# Altium schematic sheet MainBoard.SchDoc
size A2; Organization: Altium Limited; Address1: L3, 12a Rodborough Rd; Address2: Frenchs Forest; Address3: NSW; Address4: Australia 2086
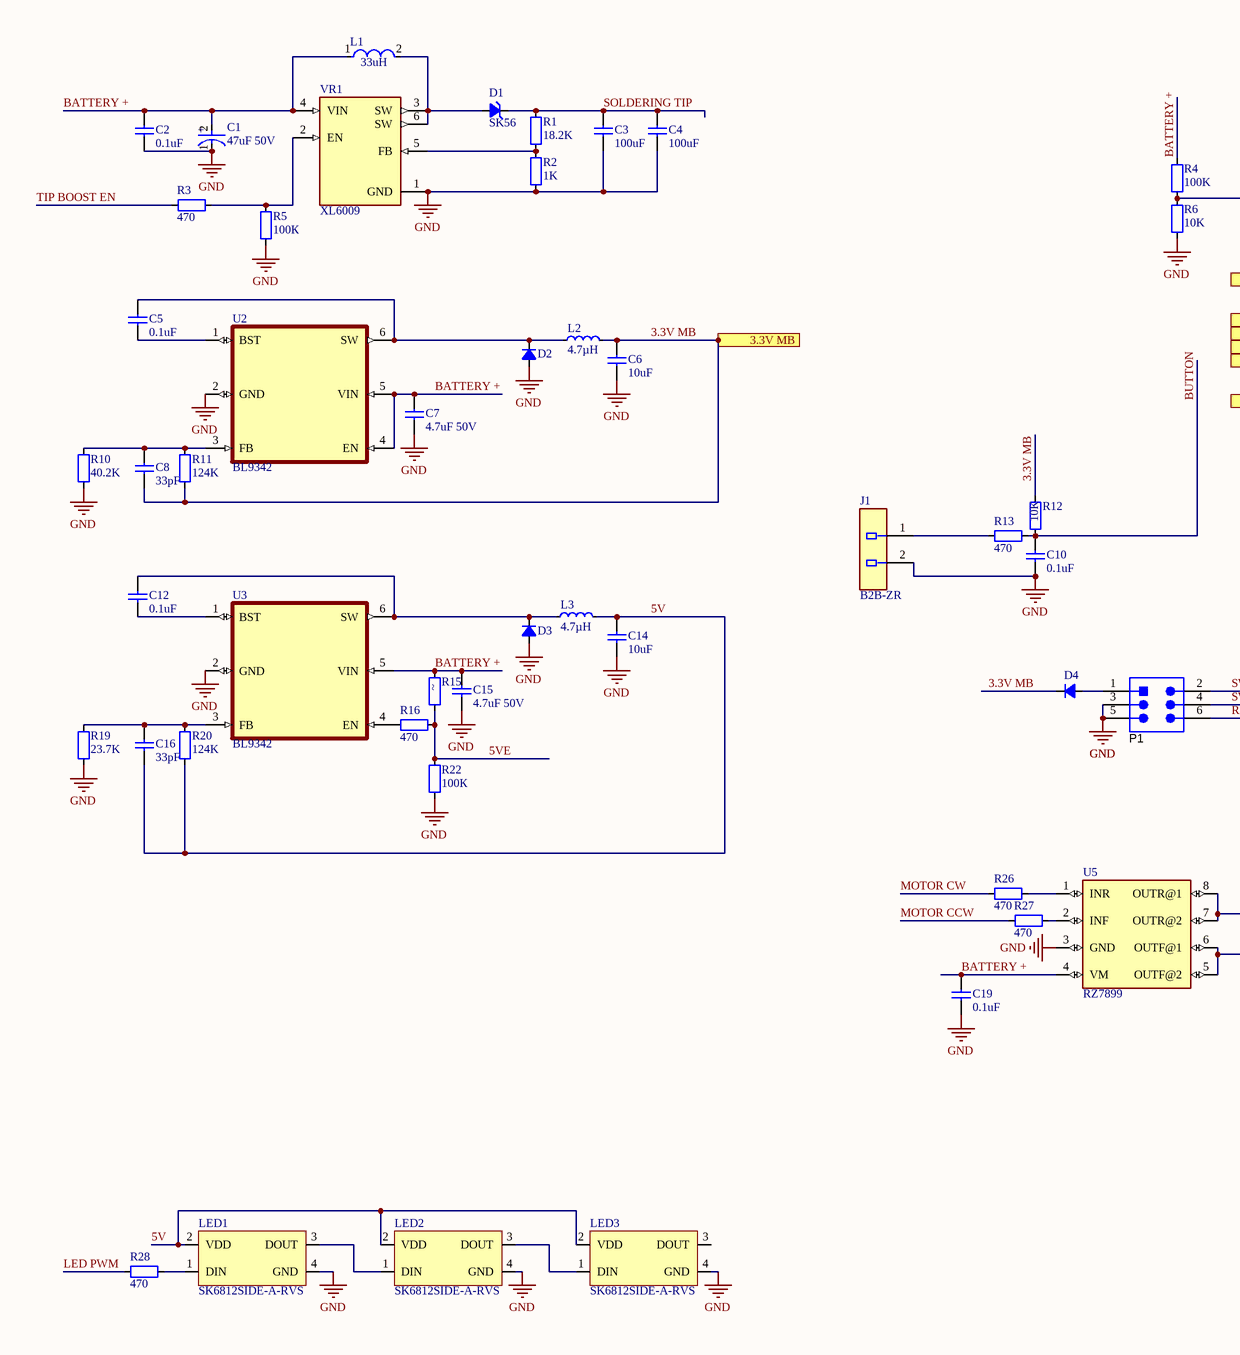
[diagram p0: MainBoard.SchDoc, left]
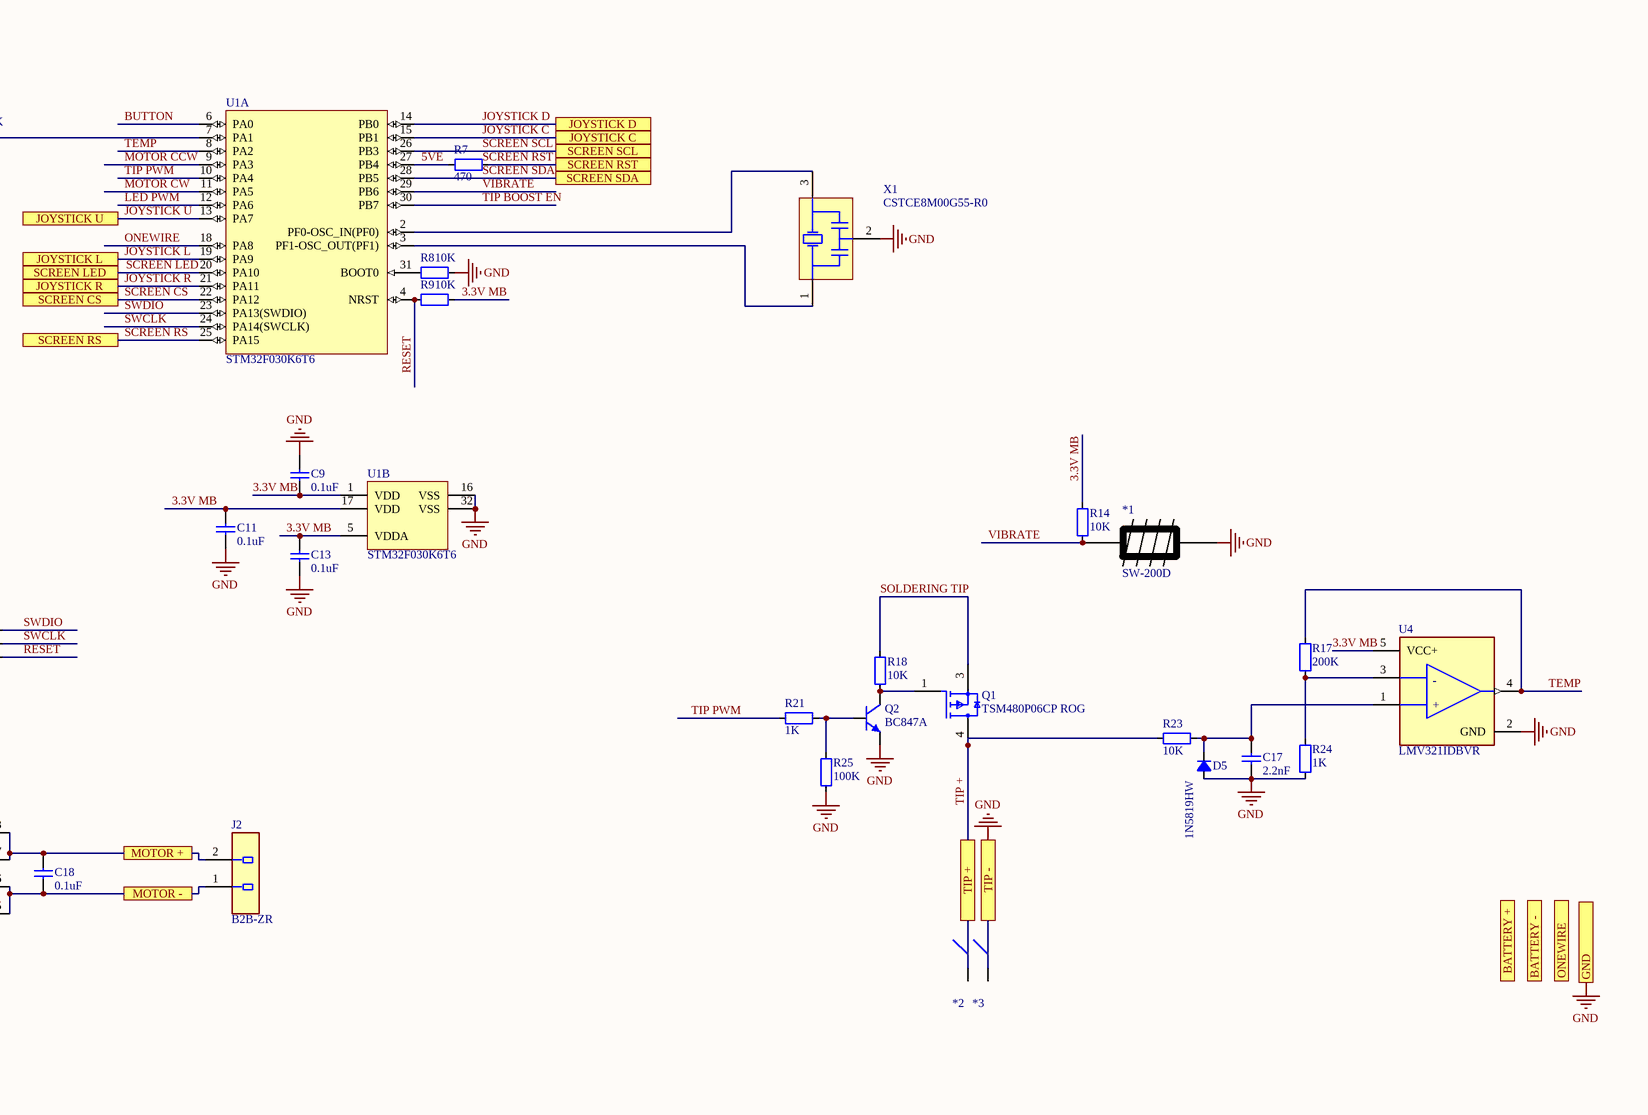
[diagram p1: MainBoard.SchDoc, right]

## Parts
*1  SW-200D  [SW-200D]
*2  Clipse  [CLIPSE]  (value not drawn)
*3  Clipse  [CLIPSE]  (value not drawn)
C1  47uF 50V  [FP-THV6.3X7.7-MFG]
C2  0.1uF  [1206]
C3  100uF  [C1210]
C4  100uF  [C1210]
C5  0.1uF  [R0603]
C6  10uF  [C0805]
C7  4.7uF 50V  [C0805]
C8  33pF  [R0603]
C9  0.1uF  [R0603]
C10  0.1uF  [R0603]
C11  0.1uF  [R0603]
C12  0.1uF  [R0603]
C13  0.1uF  [R0603]
C14  10uF  [C0805]
C15  4.7uF 50V  [C0805]
C16  33pF  [R0603]
C17  2.2nF  [R0603]
C18  0.1uF  [1206]
C19  0.1uF  [R0603]
D1  SK56  [DO-214AA(SMB)]
D2  (no value)  [SOD-123]
D3  (no value)  [SOD-123]
D4  (no value)  [SOD-123]
D5  1N5819HW  [SOD-123]
J1  Part Number: B2B-ZR  [JST_B2B-ZR_0]  (hidden comment: Conn_JST_B2B-ZR_eec)
J2  Part Number: B2B-ZR  [JST_B2B-ZR_0]  (hidden comment: Conn_JST_B2B-ZR_eec)
L1  value 33uH  [IND_1040]  (hidden comment: 1040)
L2  4.7µH  [INDC1608X06L]
L3  4.7µH  [INDC1608X06L]
LED1  SK6812SIDE-A-RVS  [SK6812SIDE-A-RVS]
LED2  SK6812SIDE-A-RVS  [SK6812SIDE-A-RVS]
LED3  SK6812SIDE-A-RVS  [SK6812SIDE-A-RVS]
P1  TSW-103-07-G-D  [DS-1025-05 - 2x3]  (value not drawn)
Q1  TSM480P06CP ROG  [FP-TO-252-MFG]
Q2  BC847A  [SOT95P237X112-3N]
R1  18.2K  [R0603]
R2  1K  [R0603]
R3  470  [R0603]
R4  100K  [R0603]
R5  100К  [R0603]
R6  10K  [R0603]
R7  470  [R0603]
R8  10K  [R0603]
R9  10K  [R0603]
R10  40.2K  [R0603]
R11  124K  [R0603]
R12  10K  [R0603]
R13  470  [R0603]
R14  10K  [R0603]
R15  ~  [R0603]
R16  470  [R0603]
R17  200K  [R0603]
R18  10K  [R0603]
R19  23.7K  [R0603]
R20  124K  [R0603]
R21  1K  [R0603]
R22  100К  [R0603]
R23  10K  [R0603]
R24  1K  [R0603]
R25  100K  [R0603]
R26  470  [R0603]
R27  470  [R0603]
R28  470  [R0603]
U1  STM32F030K6T6  [LQFP32_L]  (parts A,B of 2)
U2  BL9342  [SOT23-6]
U3  BL9342  [SOT23-6]
U4  LMV321IDBVR  [FP-DBV0005A-MFG]
U5  RZ7899  [SOP-8_2-5R1S-IPC_B]
VR1  XL6009  [DPAK170P1435X465-6N]
X1  CSTCE8M00G55-R0  [MURA-CSTCE_G_A-3_V]

## Ports
3.3V MB, BATTERY +, BATTERY -, GND, JOYSTICK C, JOYSTICK D, JOYSTICK L, JOYSTICK R, JOYSTICK U, MOTOR +, MOTOR -, ONEWIRE, SCREEN CS, SCREEN LED, SCREEN RS, SCREEN RST, SCREEN SCL, SCREEN SDA, TIP +, TIP -

## Nets
GND: *1.2 *3.1 C1.1(C) C2.1 C3.1 C4.1 C6.1 C7.1 C9.2 C10.1 C11.2 C13.2 C14.1 C15.1 C17.1 C19.2 D2.1(A) D3.1(A) D5.1(A) J1.2 LED1.4(GND) LED2.4(GND) LED3.4(GND) P1.3 P1.5 Q2.2(E) R2.2 R5.2 R6.1 R8.1 R10.1 R19.1 R22.2 R24.2 R25.1 U1.16(VSS) U1.32(VSS) U2.2(GND) U3.2(GND) U4.2(GND) U5.3(GND) VR1.1(GND) X1.2(GND) ; port TIP -, port GND
3.3V MB: C6.2 C8.1 C9.1 C11.1 C13.1 D4.2(K) L2.2 R9.1 R11.1 R12.1 R14.2 U1.1(VDD) U1.5(VDDA) U1.17(VDD) U4.5(VCC+) ; port 3.3V MB
5V: C14.2 C16.1 L3.2 LED1.2(VDD) LED2.2(VDD) LED3.2(VDD) R20.1
5VE: R7.2 R15.2 R16.1 R22.1 U1.27(PB4)
BATTERY +: C1.2(A) C2.2 C7.2 C15.2 C19.1 L1.1 R4.2 R15.1 U2.4(EN) U2.5(VIN) U3.5(VIN) U5.4(VM) VR1.4(VIN)
BUTTON: C10.2 R12.2 R13.2 U1.6(PA0)
JOYSTICK D: U1.14(PB0) ; port JOYSTICK D
JOYSTICK L: U1.19(PA9) ; port JOYSTICK L
JOYSTICK R: U1.21(PA11) ; port JOYSTICK R
JOYSTICK U: U1.13(PA7) ; port JOYSTICK U
JOYSTICK С: U1.15(PB1) ; port JOYSTICK C
LED PWM: R28.2 U1.12(PA6)
MOTOR +: C18.1 J2.2 U5.7(OUTR@2) U5.8(OUTR@1) ; port MOTOR +
MOTOR -: C18.2 J2.1 U5.5(OUTF@2) U5.6(OUTF@1) ; port MOTOR -
MOTOR CCW: R27.2 U1.9(PA3)
MOTOR CW: R26.2 U1.11(PA5)
ONEWIRE: U1.18(PA8)
RESET: P1.6 R9.2 U1.4(NRST)
SCREEN CS: U1.22(PA12) ; port SCREEN CS
SCREEN LED: U1.20(PA10) ; port SCREEN LED
SCREEN RS: U1.25(PA15) ; port SCREEN RS
SCREEN RST: R7.1 ; port SCREEN RST
SCREEN SCL: U1.26(PB3) ; port SCREEN SCL
SCREEN SDA: U1.28(PB5) ; port SCREEN SDA
SOLDERING TIP: C3.2 C4.2 D1.1(K) Q1.3(Source) R1.1 R18.2
SWCLK: P1.4 U1.24(PA14(SWCLK))
SWDIO: P1.2 U1.23(PA13(SWDIO))
TEMP: R17.1 U1.8(PA2) U4.4(OUT)
TIP +: *2.1 Q1.4(Drain) R23.1 ; port TIP +
TIP BOOST EN: R3.2 U1.30(PB7)
TIP PWM: R21.2 U1.10(PA4)
VIBRATE: *1.1 R14.1 U1.29(PB6)
NetC5_1: C5.1 U2.1(BST)
NetC5_2: C5.2 D2.2(K) L2.1 U2.6(SW)
NetC8_2: C8.2 R10.2 R11.2 U2.3(FB)
NetC12_1: C12.1 U3.1(BST)
NetC12_2: C12.2 D3.2(K) L3.1 U3.6(SW)
NetC16_2: C16.2 R19.2 R20.2 U3.3(FB)
NetC17_2: C17.2 D5.2(K) R23.2 U4.1(1IN+)
NetD1_2: D1.2(A) L1.2 VR1.3(SW) VR1.6(SW)
NetD4_1: D4.1(A) P1.1
NetJ1_1: J1.1 R13.1
NetLED1_1: LED1.1(DIN) R28.1
NetLED1_3: LED1.3(DOUT) LED2.1(DIN)
NetLED2_3: LED2.3(DOUT) LED3.1(DIN)
NetQ1_1: Q1.1(Gate) Q2.3(C) R18.1
NetQ2_1: Q2.1(B) R21.1 R25.2
NetR1_2: R1.2 R2.1 VR1.5(FB)
NetR3_1: R3.1 R5.1 VR1.2(EN)
NetR4_1: R4.1 R6.2 U1.7(PA1)
NetR8_2: R8.2 U1.31(BOOT0)
NetR16_2: R16.2 U3.4(EN)
NetR17_2: R17.2 R24.1 U4.3(1IN-)
NetR26_1: R26.1 U5.1(INR)
NetR27_1: R27.1 U5.2(INF)
NetU1_2: U1.2(PF0-OSC_IN(PF0)) X1.3(X2)
NetU1_3: U1.3(PF1-OSC_OUT(PF1)) X1.1(X1)

Not connected (* = marked no-connect by the designer): LED3 3(DOUT)

## Notes on the sheet
- Labels drawn without touching a wire or pin: SCREEN RST
- Title
- Size:
- Date:
- File:
- A2
- Number:
- Time:
- Revision:
- Sheet
- of
- (in symbol CAP ALUM SMD) +
- (in symbol LMV321) -; +

## Library data of the parts
C1 = CAP ALUM SMD: Capacitance: 100uF; Ripple Current: 175mA; Ripple Current (AC): 350mA; ESR (Equivalent Series Resistance): 250mR; Life (Hours): 3000Hour; Tolerance: 20%; Max Operating Temperature: 125°C; Height: 10.5mm; Package Quantity: 1; Radiation Hardening: No; Diameter: 10mm; Case/Package: Radial; RoHS Compliant: Yes; Voltage: 50V; REACH SVHC: No SVHC; Packaging: Cut Tape; Height - Seated (Max): 0.413inch; Voltage Rating: 50V; Min Operating Temperature: -40°C; Mount: Surface Mount; Termination: SMD/SMT; Series: THV; Construction: Cylindrical; Voltage Rating (DC): 50V
C2-C19 = CAP
  C2 C5 C9-C13 C18 C19: Value: 0.1uF
  C3 C4: Value: 100uF
  C6 C14: Value: 10uF
  C7 C15: Value: 4.7uF 50V
  C8 C16: Value: 33pF
  C17: Value: 2.2nF
D1 = DIODE_DO-214: DO-214 Diode; Manufacturer Part Number: China; Value: SK56
D2-D4 = Diode_SOD123: Schottky diode SOD123; Note: Schottky diode  SOD123
D5 = Diode_SOD123: Schottky diode SOD123 1N5819HW; Note: Schottky diode  SOD123
J1 J2 = Conn_JST_B2B-ZR_eec: CONN HEADER ZH TOP 2POS 1.5MM; Manufacturer: JST; helpURL: https://upverter.com/upn/revision/d9455d7935cb45e6/; ComponentLink2Description: Datasheet; Temperature: -25°C to +85°C; Package: HDR2_PTH; Supplier 2: Mouser; Supplier 1: Digi-Key; ComponentLink1URL: https://upverter.com/upn/revision/d9455d7935cb45e6/; Supplier Part Number 1: 455-1367-ND; ComponentLink1Description: Upverter; ComponentLink2URL: http://www.jst-mfg.com/product/pdf/eng/eZH.pdf; RoHS: FALSE; Temperature Range High: +85°C; Digikey Description: CONN HEADER ZH TOP 2POS 1.5MM; Digikey Part Number: 455-1367-ND; Temperature Range Low: -25°C; Lead Free: no
L1 = IND_1040: FIXED IND  1040 SMD; Manufacturer: Bourns; Manufacturer Part Number: SRR1210-680M; Rms Current: 3A; Shielding: true; Q Factor: 12; Series Resistance: 102mΩ; Saturation Current: 2.7A; Tolerance: 20%; Core Material: Ferrite; Self Resonant Frequency: 3.8MHz; Test Frequency: 2.52MHz; ComponentLink2Description: Datasheet; Device Class L3: Fixed Inductors; Lead Free: Yes; Composition: Wirewound; Temperature: -40°C to +125°C; Automotive: No; RoHS: TRUE; Category: Ind; Device Class L2: Inductors; Height: 10mm; Temperature Range Low: -40°C; Device Class L1: Passive Components; Temperature Range High: +125°C; Mouser Description: Fixed Inductors 68uH 20% SMD 1210; ComponentLink2URL: https://www.bourns.com/docs/Product-Datasheets/SRR1210.pdf; Digikey Description: FIXED IND 68UH 3A 102 MOHM SMD; Octopart: https://octopart.com/srr1210-680m-bourns-10487145
L2 L3 = IND_1: Inductor, SMD; Part Number: L0603-10µ; Manufacturer: Taiyo Yuden; Manufacturer Part Number: LBMF1608T100K; Note: Inductor 10uH 10% 80mA 360mOhm 0603; Datasheet: http://www.yuden.co.jp/ut/product/pdf/elb2_e.pdf; Footprint: 0603; LatestRevisionDate: 2012-09-19; Pin Count: 2; Publisher: Nordic Semiconductor; Published: 2010-02-24; Value: 4.7µH
LED1-LED3 = SK6812SIDE-A-RVS: 2mA -40℃~+85℃ RGB SMD,2x4mm Light Emitting Diodes (LED) ROHS
P1 = DS-1025-05 - 2x3: Through Hole Header, Pitch 2.54 mm, 2 x 3 Position, Height 8.58 mm, Tail Length 2.54 mm, -55 to 125 degC, RoHS, Bulk; Manufacturer: Samtec-Inc.; Manufacturer: Samtec; Number of Positions Loaded: All; Number of Positions: 6; Row Spacing: 0.100"(2.54mm); Connector Type: Header,Unshrouded; Package Reference: TSW-103-07-G-D; Termination: Solder; Manufacturer URL: http://www.samtec.com/; Contact Finish: Gold; Contact Mating Length: 0.230"(5.84mm); Package Description: Through Hole Header, Pitch 2.54 mm, 2 x 3 Position, Height 8.58 mm, Tail Length 2.54 mm; Datasheet Version: 12/2015; Number of Rows: 2; Features: -; Family: RectangularConnectors-Headers,MalePins; Fastening Type: -; Datasheet URL: http://suddendocs.samtec.com/catalog_english/tsw_th.pdf; Category: Connectors,Interconnects; Package URL: http://suddendocs.samtec.com/prints/tsw-xxx-xx-xxx-x-xx-xxx-mkt.pdf; Mounting Type: ThroughHole; Contact Finish Thickness: 10µin(0.25µm); Packaging: Bulk; Color: Black; Pitch: 0.100"(2.54mm); Series: TSW; Contact Type: MalePin; Mounting Technology: ThroughHole; Manufacturer Part Number: TSW-103-07-G-D
Q1 = TSM480P06CP ROG: MOSFET P-CHANNEL 60V 20A TO252; Rds On Max: 48mR; Max Power Dissipation: 66W; Input Capacitance: 1.25nF; Mount: Surface Mount; Case/Package: TO-252-3; Min Operating Temperature: -50°C; Continuous Drain Current (ID): 20A; Drain to Source Voltage (Vdss): 60V; Packaging: Cut Tape; RoHS Compliant: Yes; Max Operating Temperature: 150°C
Q2 = BC846A: NPN Silicon AF Transistor, 45 V VCEO, 100 mA IC, SOT23, Reel, Green; Manufacturer: DIOTEC; Note: NPN Silicon AF Transistor, 45 V VCEO, 100 mA IC, SOT23, Reel, Green; ComponentLink3URL: http://www.infineon.com/dgdl/SOT23-Package_Overview.pdf?folderId=db3a30431936bc4b0119532290053c66&fileId=db3a30431936bc4b0119533468123c85; ComponentLink3Description: Package Specification; ComponentLink2URL: http://www.infineon.com/dgdl/bc847series_bc848series_bc849series_bc850series.pdf?folderId=db3a304314dca389011541d30fa21656&fileId=db3a304314dca389011541d4630a1657; ComponentLink1URL: http://www.infineon.com/; ComponentLink2Description: Datasheet; ComponentLink1Description: Manufacturer URL; Manufacturer Part Number: BC847A
R1-R28 = RES SMD UNI: Resistor SMD; Category: Resistors
  R1: Value: 18.2K
  R2 R21 R24: Value: 1K
  R3 R7 R13 R16 R26-R28: Value: 470
  R4 R25: Value: 100K
  R5 R22: Value: 100К
  R6 R8 R9 R12 R14 R18 R23: Value: 10K
  R10: Value: 40.2K
  R11 R20: Value: 124K
  R15: Value: ~
  R17: Value: 200K
  R19: Value: 23.7K
U1 = CMP-0304-00020-2: ARM Cortex-M0 32-bit MCU, 32 KB Flash, 4 KB Internal RAM, 26 I/Os, 32-pin LQFP, -40 to 85 degC, Tray; I/Os (High Current): 26; FLASH Size (Prog) (kB): 32; Operating Frequency(F) (Processor speed) (MHz): 48; Supply Voltage(Vcc) min (V): 2.4; Internal RAM Size (kB): 4; PackageDescription: 32-Pin Low Profile Quad Flat Package, 7 x 7 mm Body, 0.8 mm Pitch; Core: ARM Cortex-M0; PackageVersion: Rev. 1, 07/2013; ComponentLink1Description: Manufacturer URL; ComponentLink2URL: http://www.st.com/st-web-ui/static/active/en/resource/technical/document/datasheet/DM00088500.pdf; PackageReference: LQFP32; PartNumber: STM32F030K6T6; Mounting Technology: Surface Mount; DatasheetVersion: Rev. 1; ComponentLink2Description: Datasheet; ComponentLink3URL: http://www.st.com/st-web-ui/static/active/en/resource/technical/document/datasheet/DM00088500.pdf; ComponentLink1URL: http://www.st.com/web/en/home.html; ComponentLink3Description: Package Specification; Packing: Tray
U2 U3 = BL9342: MF: {'manufacturer': u'Texas Instruments'}; Package: None; MP: BL9342; Value: *; Price: None; Availability: Unavailable
U4 = LMV321: IC OPAMP GP 1 CIRCUIT SOT23-5; Manufacturer: Texas Instruments; Bandwidth: 1MHz; Number Of Channels: 1; Max Junction Temp: +150°C; Input Offset Voltage: 1.7mV; Standoff Height: 0mm; Voltage Gain: 100V/mV; Min Supply Voltage: 2.7V; Input Bias Current: 0.015uA; Nominal Supply Current: 80-130uA; Max Supply Voltage: 5.5V; Ambient Temperature Range Low: -40°C; Device Class L3: Amplifiers - Op Amps; Package: DBV0005A; Temperature: -40°C to +125°C; Automotive: No; Ambient Temperature Range High: +125°C; ComponentLink2Description: Datasheet; Manufacturer Part Number: LMV321IDBVR; Octopart: https://octopart.com/lmv321idbvr-texas+instruments-410381; ComponentLink2URL: http://www.ti.com/lit/ds/symlink/lmv321.pdf; Temperature Range High: +125°C; Device Class L1: Integrated Circuits (ICs); Temperature Range Low: -40°C; Digikey Description: IC OPAMP GP 1 CIRCUIT SOT23-5; RoHS: TRUE; Height: 1.45mm; Mouser Description: Operational Amplifiers - Op Amps Low V R/R; Device Class L2: Linear ICs; Gain Bandwidth: 1MHz; Lead Free: Yes; Category: IC
U5 = RZ7899: MF: {'manufacturer': u'Wuxi'}; Availability: Unavailable; Value: *; Package: None; Price: None; MP: RZ7899
VR1 = XL6009: The XL6009 regulator is a wide input range, current mode, DC/DC converter which is capable of generating either positive or negative output voltages.; MF: {'manufacturer': u'XLSEMI'}; Price: None; Package: None; Availability: Unavailable; Value: *; MP: XL6009
X1 = XTAL_SMD: Ceramic Resonator, 8 MHz, +/- 0.5%, -20 to 80 degC, 3-Pin SMD, RoHS, Tape and Reel; Manufacturer: Murata; Capacitance: 33pF; Frequency Stability: 0.2%; Self Resonant Frequency: 8MHz; Datasheet Version: 42339.0; RoHSCompliant: True; Datasheet URL: http://www.murata.com/~/media/webrenewal/support/library/catalog/products/timingdevice/ceralock/p16e.ashx; Case/Package: Ceramic; Load Capacitance: 33pF; Tolerance: 0.5%; Mount: SurfaceMount; Height: 0.031inch; Number of Pins: 3; Package Description: 3-Pin Surface Mount Device, Body 3.2 x 1.3 mm, Pitch 1.2 mm; Package Quantity: 1; Lead Free: LeadFree; Contact Plating: Gold; REACH SVHC: NoSVHC; Length: 0.126inch; Width: 0.051inch; Manufacturer URL: http://www.murata.com/; Packaging: TapeandReel; Termination: SMD/SMT; Frequency Tolerance: 0.5%; Max Operating Temperature: 80degC; Composition: Ceramic; Package Reference: CSTCE_G_A-3; Min Operating Temperature: -20degC; Frequency: 8MHz